# Altium schematic sheet MAIN.SchDoc
size B
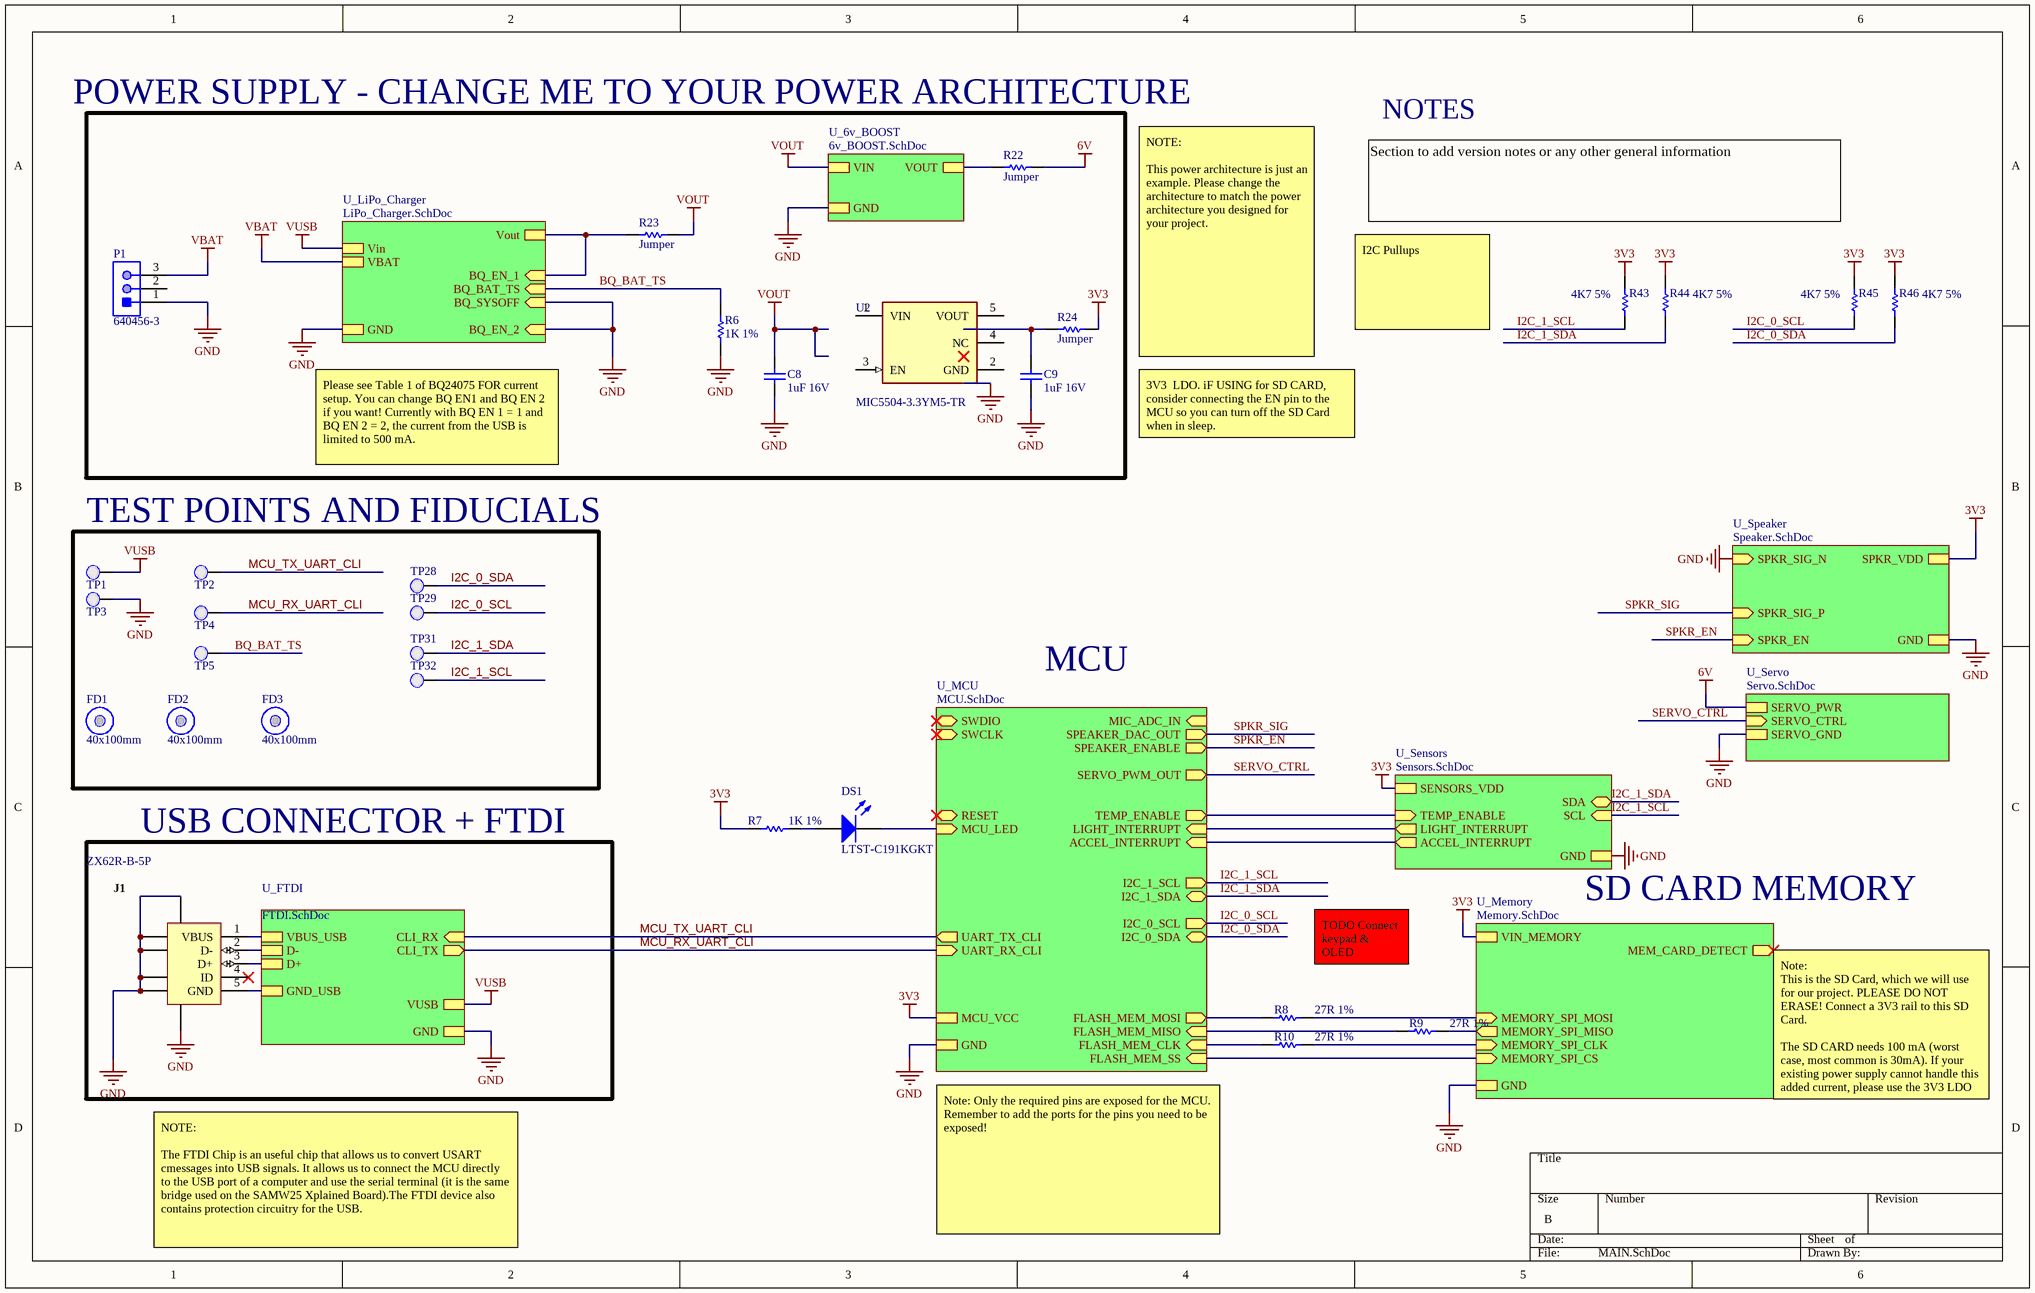
[diagram p0: MAIN.SchDoc]

## Parts
C8  1uF 16V  [CAPC0603(1608)100_N]
C9  1uF 16V  [CAPC0603(1608)100_N]
DS1  LTST-C191KGKT  [LITE-ON-LTST-C191KRKT-2_V]
FD1  40x100mm  [Fiducial_FT]
FD2  40x100mm  [Fiducial_FT]
FD3  40x100mm  [Fiducial_FT]
J1  ZX62R-B-5P  [HIRO-ZX62R-B-5P_V]
P1  640456-3  [TECO-640456-3]
R6  1K 1%  [RESC0603(1608)_N]
R7  1K 1%  [RESC0603(1608)_N]
R8  27R 1%  [RESC0603(1608)_N]
R9  27R 1%  [RESC0603(1608)_N]
R10  27R 1%  [RESC0603(1608)_N]
R22  Jumper  [RESC0805(2012)_N]
R23  Jumper  [RESC0805(2012)_N]
R24  Jumper  [RESC0805(2012)_N]
R43  4K7 5%  [RESC0402(1005)_L]
R44  4K7 5%  [RESC0402(1005)_L]
R45  4K7 5%  [RESC0402(1005)_L]
R46  4K7 5%  [RESC0402(1005)_L]
TP1  0.1" Pad  [PCBComponent]  (value not drawn)
TP2  0.1" Pad  [PCBComponent]  (value not drawn)
TP3  0.1" Pad  [PCBComponent]  (value not drawn)
TP4  0.1" Pad  [PCBComponent]  (value not drawn)
TP5  0.1" Pad  [PCBComponent]  (value not drawn)
TP28  0.1" Pad  [PCBComponent]  (value not drawn)
TP29  0.1" Pad  [PCBComponent]  (value not drawn)
TP31  0.1" Pad  [PCBComponent]  (value not drawn)
TP32  0.1" Pad  [PCBComponent]  (value not drawn)
U2  MIC5504-3.3YM5-TR  [FP-SOT23-5LD-PL-1-MFG]

## Blocks framed on the sheet
TEST POINTS AND FIDUCIALS: FD1-FD3 TP1-TP5 TP28 TP29 TP31 TP32
USB CONNECTOR + FTDI: J1

## Sub-sheets
U_6v_BOOST = 6v_BOOST.SchDoc: VIN, VOUT, GND
U_FTDI = FTDI.SchDoc: CLI_RX (in), CLI_TX (out), VUSB, GND, VBUS_USB, D-, D+, GND_USB
U_LiPo_Charger = LiPo_Charger.SchDoc: BQ_EN_2 (in), BQ_SYSOFF (in), BQ_EN_1 (in), BQ_BAT_TS (in), Vin, Vout, GND, VBAT
U_MCU = MCU.SchDoc: SWDIO (bidir), SWCLK (in), UART_TX_CLI (out), UART_RX_CLI (in), FLASH_MEM_SS (in), FLASH_MEM_CLK (in), FLASH_MEM_MISO (in), FLASH_MEM_MOSI (out), RESET (bidir), MCU_LED (in), MCU_VCC, GND, MIC_ADC_IN (in), SERVO_PWM_OUT (out), I2C_1_SDA (bidir), SPEAKER_DAC_OUT (out), I2C_0_SDA (bidir), I2C_1_SCL (out), I2C_0_SCL (out), SPEAKER_ENABLE (out), ACCEL_INTERRUPT (in), TEMP_ENABLE (out), LIGHT_INTERRUPT (in)
U_Memory = Memory.SchDoc: MEMORY_SPI_MOSI (in), MEMORY_SPI_MISO (out), MEMORY_SPI_CLK (in), MEMORY_SPI_CS (in), MEM_CARD_DETECT (out), VIN_MEMORY, GND
U_Sensors = Sensors.SchDoc: SCL (in), SENSORS_VDD, GND, SDA (bidir), TEMP_ENABLE (in), LIGHT_INTERRUPT (out), ACCEL_INTERRUPT (out)
U_Servo = Servo.SchDoc: SERVO_PWR, SERVO_GND, SERVO_CTRL (in)
U_Speaker = Speaker.SchDoc: SPKR_SIG_N (in), SPKR_EN (in), GND, SPKR_VDD, SPKR_SIG_P (in)

## Nets
3V3: R7.1 R24.2 R43.2 R44.2 R45.2 R46.2 ; sheet U_MCU/MCU_VCC, sheet U_Memory/VIN_MEMORY, sheet U_Speaker/SPKR_VDD, sheet U_Sensors/SENSORS_VDD
6V: R22.2 ; sheet U_Servo/SERVO_PWR
GND: C8.1 C9.1 J1.6(SHLD) J1.7(SHLD) J1.8(SHLD) J1.9(SHLD) J1.10(SHLD) J1.11(SHLD) P1.1 R6.2 TP3.1(PAD) ; sheet U_FTDI/GND, sheet U_MCU/GND, sheet U_Memory/GND, sheet U_LiPo_Charger/BQ_EN_2, sheet U_LiPo_Charger/BQ_SYSOFF, sheet U_LiPo_Charger/GND, sheet U_6v_BOOST/GND, sheet U_Speaker/SPKR_SIG_N, sheet U_Speaker/GND, sheet U_Servo/SERVO_GND, sheet U_Sensors/GND
VBAT: P1.3 ; sheet U_LiPo_Charger/VBAT
VOUT: C8.2 R23.2 ; sheet U_6v_BOOST/VIN
VUSB: TP1.1(PAD) ; sheet U_FTDI/VUSB, sheet U_LiPo_Charger/Vin
BQ_BAT_TS: R6.1 TP5.1(PAD) ; sheet U_LiPo_Charger/BQ_BAT_TS
I2C_0_SCL: R45.1 TP29.1(PAD) ; sheet U_MCU/I2C_0_SCL
I2C_0_SDA: R46.1 TP28.1(PAD) ; sheet U_MCU/I2C_0_SDA
I2C_1_SCL: R43.1 TP32.1(PAD) ; sheet U_MCU/I2C_1_SCL, sheet U_Sensors/SCL
I2C_1_SDA: R44.1 TP31.1(PAD) ; sheet U_MCU/I2C_1_SDA, sheet U_Sensors/SDA
MCU_RX_UART_CLI: TP4.1(PAD) ; sheet U_FTDI/CLI_TX, sheet U_MCU/UART_RX_CLI
MCU_TX_UART_CLI: TP2.1(PAD) ; sheet U_FTDI/CLI_RX, sheet U_MCU/UART_TX_CLI
SERVO_CTRL: sheet U_MCU/SERVO_PWM_OUT, sheet U_Servo/SERVO_CTRL
SPKR_EN: sheet U_MCU/SPEAKER_ENABLE, sheet U_Speaker/SPKR_EN
SPKR_SIG: sheet U_MCU/SPEAKER_DAC_OUT, sheet U_Speaker/SPKR_SIG_P
NetC9_2: C9.2 R24.1
NetDS1_1: DS1.1(A) R7.2
NetDS1_2: DS1.2(K) ; sheet U_MCU/MCU_LED
NetJ1_1: J1.1(VBUS) ; sheet U_FTDI/VBUS_USB
NetJ1_2: J1.2(D-) ; sheet U_FTDI/D-
NetJ1_3: J1.3(D+) ; sheet U_FTDI/D+
NetJ1_5: J1.5(GND) ; sheet U_FTDI/GND_USB
NetR8_1: R8.1 ; sheet U_MCU/FLASH_MEM_MOSI
NetR8_2: R8.2 ; sheet U_Memory/MEMORY_SPI_MOSI
NetR9_1: R9.1 ; sheet U_MCU/FLASH_MEM_MISO
NetR9_2: R9.2 ; sheet U_Memory/MEMORY_SPI_MISO
NetR10_1: R10.1 ; sheet U_MCU/FLASH_MEM_CLK
NetR10_2: R10.2 ; sheet U_Memory/MEMORY_SPI_CLK
NetR22_1: R22.1 ; sheet U_6v_BOOST/VOUT
NetR23_1: R23.1 ; sheet U_LiPo_Charger/BQ_EN_1, sheet U_LiPo_Charger/Vout
(unnamed): sheet U_MCU/FLASH_MEM_SS, sheet U_Memory/MEMORY_SPI_CS
(unnamed): sheet U_MCU/ACCEL_INTERRUPT, sheet U_Sensors/ACCEL_INTERRUPT
(unnamed): sheet U_MCU/TEMP_ENABLE, sheet U_Sensors/TEMP_ENABLE
(unnamed): sheet U_MCU/LIGHT_INTERRUPT, sheet U_Sensors/LIGHT_INTERRUPT

Not connected (* = marked no-connect by the designer): J1 4(ID)*; P1 2; U2 1(VIN) 2(GND) 3(EN) 4(NC) 5(VOUT)

## Notes on the sheet
- POWER SUPPLY - CHANGE ME TO YOUR POWER ARCHITECTURE
- NOTES
- Section to add version notes or any other general information
- NOTE:
  This power architecture is just an example. Please change the architecture to match the power architecture you designed for your project.
- I2C Pullups
- 3V3  LDO. iF USING for SD CARD, consider connecting the EN pin to the MCU so you can turn off the SD Card when in sleep.
- Please see Table 1 of BQ24075 FOR current setup. You can change BQ EN1 and BQ EN 2 if you want! Currently with BQ EN 1 = 1 and BQ EN 2 = 2, the current from the USB is limited to 500 mA.
- MCU
- SD CARD MEMORY
- TODO Connect keypad & OLED
- Note:
  This is the SD Card, which we will use for our project. PLEASE DO NOT ERASE! Connect a 3V3 rail to this SD Card.
  The SD CARD needs 100 mA (worst case, most common is 30mA). If your existing power supply cannot handle this added current, please use the 3V3 LDO found in this project to power your SD Card.
- NOTE:
  The FTDI Chip is an useful chip that allows us to convert USART cmessages into USB signals. It allows us to connect the MCU directly to the USB port of a computer and use the serial terminal (it is the same bridge used on the SAMW25 Xplained Board).The FTDI device also contains protection circuitry for the USB.
- Note: Only the required pins are exposed for the MCU. Remember to add the ports for the pins you need to be exposed!

## Library data of the parts
C8 C9 = CMP-1035-02736-1: CAP 1uF 16V ±5% 0603 (1608 Metric) Thickness 1mm SMD; Case-Metric: 1608; Case-EIA: 0603; Tolerance: Â±5%; Technology: SMT; Max Thickness: 1 mm; Rated Voltage: 16 V; Value: 1uF
DS1 = CMP-2000-05198-1: Chip LED, Green, 574 nm, 40 pF, -55 to 85 degC, 2-Pin SMD, RoHS, Tape and Reel; Manufacturer: Lite-On; Rad Hardened: No; Emitting Color: YellowGreen; Product Height (mm): 0.55mm; Forward Voltage: 2.4V; Number of Elements: 1; Dominant Wave Length: 571nm; DELETED: Compliant; Viewing Angle: 130deg; High Brightness: Yes; Peak Wavelength: 574nm; Type: Uni-Color; Forward Current: 30mA; Product Length (mm): 1.6mm; Luminous Intensity: 35mcd; Test Current (It): 20mA; Chip Material: AlGaInP; Product Depth (mm): 0.8mm; Shape Type: Rectangular; Reverse Voltage: 5V; Power Dissipation: 75W; Pin Count: 2; Lens Dimensions: 1.1X0.8X0.37mm; Packaging: TapeandReel; Main Category: ChipLED; Operating Temperature Classification: Industrial; Package Type: ChipLed; Mounting: SurfaceMount; Lum Intensity: 35mcd; Operating Temp Range: -55Cto85C; Datasheet Version: Jan-07; Datasheet URL: http://download.siliconexpert.com/pdfs/2007/08/26/semi_b/manual/lot/ds/ltst-c191kgkt.pdf; Manufacturer URL: http://www.us.liteon.com/
FD1-FD3 = CMP-00174-A.4: Fiducial 40x100mm
J1 = CMP-0031-00001-1: Connector; USBMicro-B,Reverse type, SMT; 5 Position; Right Angle; DatasheetVersion: 08/2010; Operating Temperature: -30 to 85 degC; Mounting Technology: Surface Mount; PartNumber: ZX62R-B-5P; PackageReference: ZX62R-B-5P; ComponentLink2URL: http://www.hirose.co.jp/cataloge_hp/e24200011.pdf; ComponentLink1URL: http://www.hirose.com/â€Ž; ComponentLink2Description: Datasheet; PackageDescription: 5-Pin USB Micro-B R/A Connector; ComponentLink1Description: Manufacturer URL
P1 = CMP-2000-05418-1: Male Header, Pitch 2.54 mm, 1 x 3 Position, Height 10.03 mm, Tail Length 3.56 mm, -55 to 105 degC; Manufacturer: TE Connectivity; Agency Approvals: CSA,UL; Angle: Straight; Number of Positions: 3; Standards: RoHSCompliant,ELVCompliant,UL94V-0; Current, Rating: 5 / A; Connector Type: MTA-100; Mount Angle: Vertical; Material, Housing: Polyester; Temperature, Operating: -55to+105 / degC; Voltage, Rating: 250 / V; Color, Housing: White; Contact Centerline Spacing: 0.100 / in.; Special Features: Pinstrip; Material, Contact: CopperAlloy; Contact Termination Area Plating: Tin; Primary Type: InterconnectSystem; Pin Spacing: 0.1 / "; Brand/Series: MTA-100Series; Mounting Hole Size: 0.04 / "; Manufacturer URL: http://www.te.com/; Datasheet URL: https://datasheet.ciiva.com/16456/eng-ds-82056-mta-0608-16456886.pdf; Flammability Rating: UL94V-0; Mounting Type: PCMount; Contact Mating Area Plating: Tin; Datasheet Version: Jun-08; Number of Rows: 1; Termination: Solder; Type: PCBPlug; Length, Pin: 0.14 / "; Color: White; Contact Plating: Tin; Contact Shape: Square; Number of Contacts: 3; Size, Post: 0.025 / in.; Length, Terminal Post: 0.14 / in.; Length, Overall: 0.3 / "
R6 R7 = CMP-1012-00510-1: 1K 0.1W 1% 0603 (1608 Metric)  SMD; Case-Metric: 1608; Case-EIA: 0603; Value: 1000.00 Ohm; Technology: SMT; Tolerance: 1 %; Power: 0.1 W
R8-R10 = CMP-1012-00331-1: 27R 0.1W 1% 0603 (1608 Metric)  SMD; Case-EIA: 0603; Value: 27.00 Ohm; Case-Metric: 1608; Technology: SMT; Tolerance: 1 %; Power: 0.1 W
R22-R24 = CMP-1013-00001-1: Jumper 0805 (2012 Metric); Case-EIA: 0805; Value: 0.00 Ohm; Tolerance: None; Case-Metric: 2012; Technology: SMT; Power: None
R43-R46 = CMP-1011-00090-1: 4K7 0.063W 5% 0402 (1005 Metric)  SMD; Value: 4700.00 Ohm; Case-EIA: 0402; Case-Metric: 1005; Tolerance: 5 %; Power: 0.063 W; Technology: SMT
TP1-TP5 TP28 TP29 TP31 TP32 = 0.1" Pad-A.4
U2 = CMP-2000-07604-2: IC REG LINEAR 3.3V 300MA SOT23-5; Dropout Voltage: 380mV; Min Input Voltage: 2.5V; Max Input Voltage: 5.5V; Quiescent Current: 38uA; Operating Supply Current: 42uA; Output Type: Fixed; Power Supply Rejection Ratio (PSRR): 60dB; Accuracy: 3%; Number of Outputs: 1; Number of Pins: 5; Output Current: 300mA; Min Operating Temperature: -40°C; Max Operating Temperature: 125°C; Packaging: Tape and Reel; Mount: Surface Mount; Nominal Output Voltage: 3.3V; Output Voltage: 3.3V; REACH SVHC: No SVHC; Max Output Current: 300mA; Length: 2.9mm; Width: 1.6mm; Height: 1.1mm; Case/Package: SOT-23-5